# EAGLE schematic SP_proto (EAGLE 9.0.0)
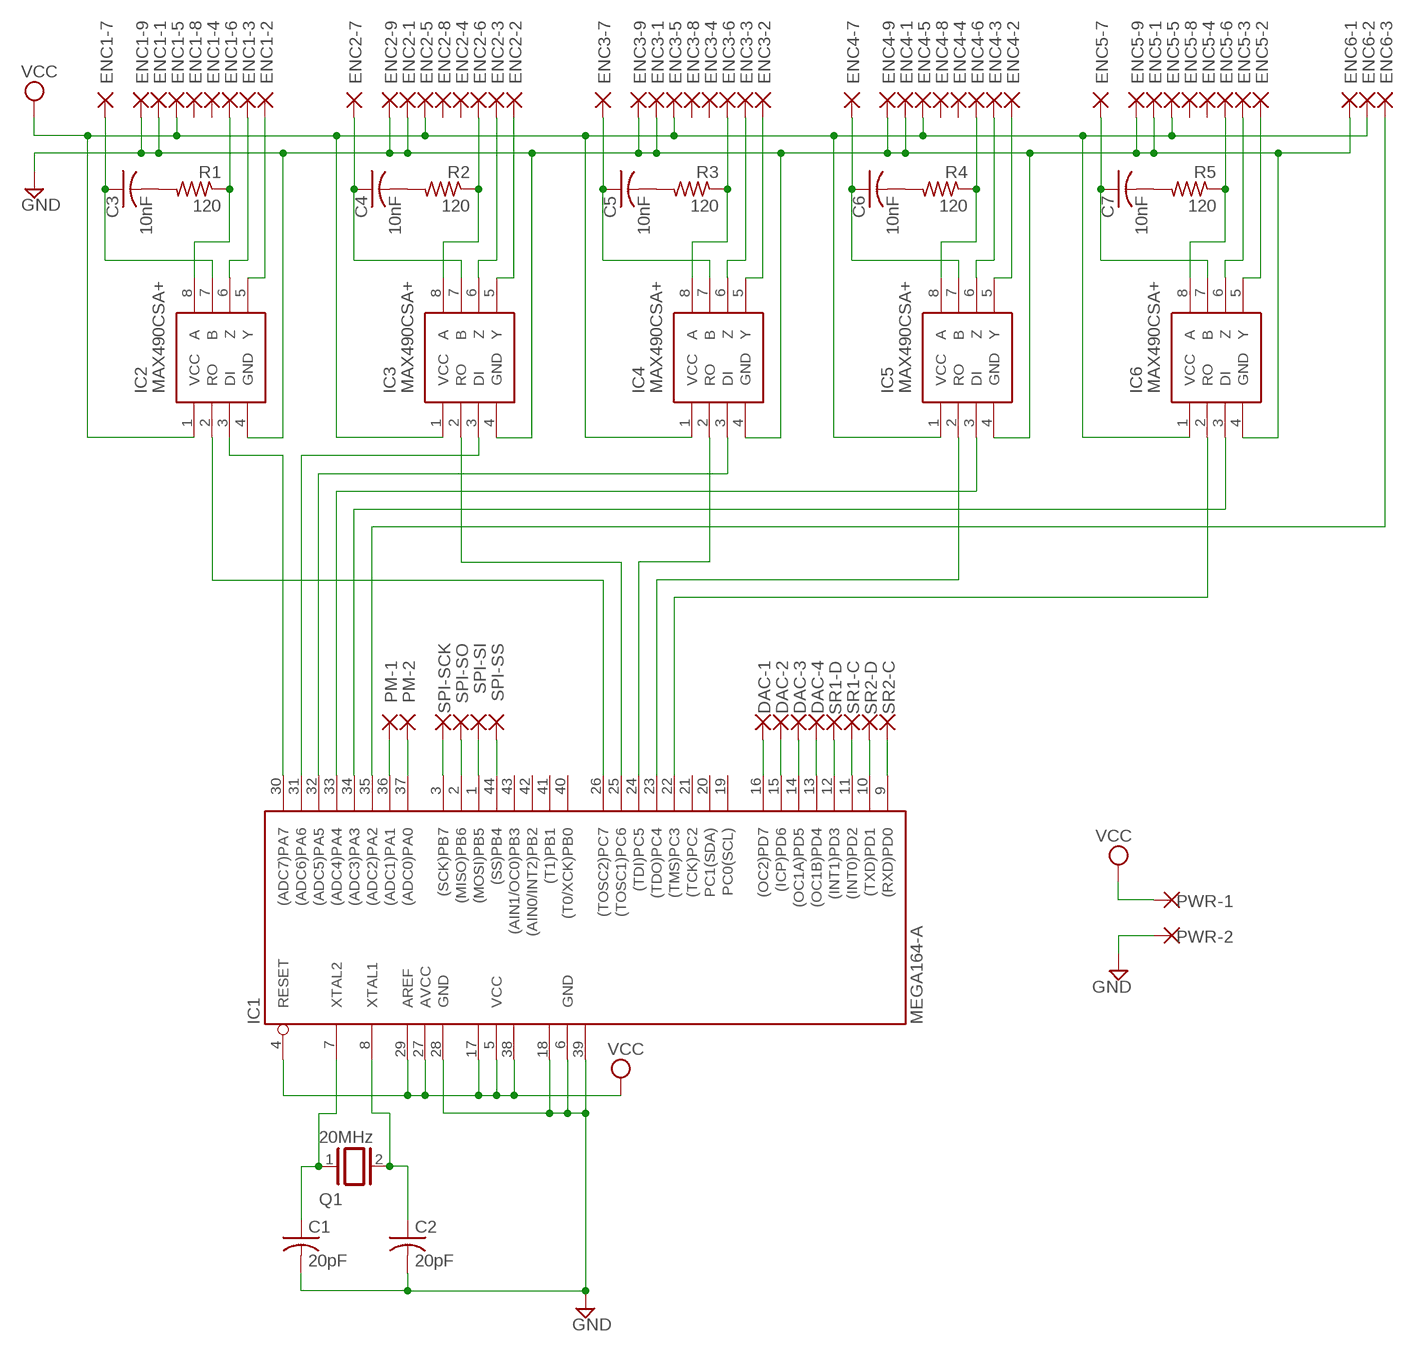
[diagram p0: schematic, sheet 1]

## Parts
C1  20pF  C-US050-024X044  [C050-024X044]
C2  20pF  C-US050-024X044  [C050-024X044]
C3  10nF  C-US050-024X044  [C050-024X044]
C4  10nF  C-US050-024X044  [C050-024X044]
C5  10nF  C-US050-024X044  [C050-024X044]
C6  10nF  C-US050-024X044  [C050-024X044]
C7  10nF  C-US050-024X044  [C050-024X044]
DAC-1  1,6/0,8  [1,6/0,8]
DAC-2  1,6/0,8  [1,6/0,8]
DAC-3  1,6/0,8  [1,6/0,8]
DAC-4  1,6/0,8  [1,6/0,8]
ENC1-1  1,6/0,8  [1,6/0,8]
ENC1-2  1,6/0,8  [1,6/0,8]
ENC1-3  1,6/0,8  [1,6/0,8]
ENC1-4  1,6/0,8  [1,6/0,8]
ENC1-5  1,6/0,8  [1,6/0,8]
ENC1-6  1,6/0,8  [1,6/0,8]
ENC1-7  1,6/0,8  [1,6/0,8]
ENC1-8  1,6/0,8  [1,6/0,8]
ENC1-9  1,6/0,8  [1,6/0,8]
ENC2-1  1,6/0,8  [1,6/0,8]
ENC2-2  1,6/0,8  [1,6/0,8]
ENC2-3  1,6/0,8  [1,6/0,8]
ENC2-4  1,6/0,8  [1,6/0,8]
ENC2-5  1,6/0,8  [1,6/0,8]
ENC2-6  1,6/0,8  [1,6/0,8]
ENC2-7  1,6/0,8  [1,6/0,8]
ENC2-8  1,6/0,8  [1,6/0,8]
ENC2-9  1,6/0,8  [1,6/0,8]
ENC3-1  1,6/0,8  [1,6/0,8]
ENC3-2  1,6/0,8  [1,6/0,8]
ENC3-3  1,6/0,8  [1,6/0,8]
ENC3-4  1,6/0,8  [1,6/0,8]
ENC3-5  1,6/0,8  [1,6/0,8]
ENC3-6  1,6/0,8  [1,6/0,8]
ENC3-7  1,6/0,8  [1,6/0,8]
ENC3-8  1,6/0,8  [1,6/0,8]
ENC3-9  1,6/0,8  [1,6/0,8]
ENC4-1  1,6/0,8  [1,6/0,8]
ENC4-2  1,6/0,8  [1,6/0,8]
ENC4-3  1,6/0,8  [1,6/0,8]
ENC4-4  1,6/0,8  [1,6/0,8]
ENC4-5  1,6/0,8  [1,6/0,8]
ENC4-6  1,6/0,8  [1,6/0,8]
ENC4-7  1,6/0,8  [1,6/0,8]
ENC4-8  1,6/0,8  [1,6/0,8]
ENC4-9  1,6/0,8  [1,6/0,8]
ENC5-1  1,6/0,8  [1,6/0,8]
ENC5-2  1,6/0,8  [1,6/0,8]
ENC5-3  1,6/0,8  [1,6/0,8]
ENC5-4  1,6/0,8  [1,6/0,8]
ENC5-5  1,6/0,8  [1,6/0,8]
ENC5-6  1,6/0,8  [1,6/0,8]
ENC5-7  1,6/0,8  [1,6/0,8]
ENC5-8  1,6/0,8  [1,6/0,8]
ENC5-9  1,6/0,8  [1,6/0,8]
ENC6-1  1,6/0,8  [1,6/0,8]
ENC6-2  1,6/0,8  [1,6/0,8]
ENC6-3  1,6/0,8  [1,6/0,8]
IC1  MEGA164-A  MEGA16-A  [TQFP44]
IC2  MAX490CSA+  [SOIC127P600X175-8N]
IC3  MAX490CSA+  [SOIC127P600X175-8N]
IC4  MAX490CSA+  [SOIC127P600X175-8N]
IC5  MAX490CSA+  [SOIC127P600X175-8N]
IC6  MAX490CSA+  [SOIC127P600X175-8N]
PM-1  1,6/0,8  [1,6/0,8]
PM-2  1,6/0,8  [1,6/0,8]
PWR-1  1,6/0,8  [1,6/0,8]
PWR-2  1,6/0,8  [1,6/0,8]
Q1  20MHz  XTAL/S  [QS]
R1  120  R-US_0204/7  [0204/7]
R2  120  R-US_0204/7  [0204/7]
R3  120  R-US_0204/7  [0204/7]
R4  120  R-US_0204/7  [0204/7]
R5  120  R-US_0204/7  [0204/7]
SPI-SCK  1,6/0,8  [1,6/0,8]
SPI-SI  1,6/0,8  [1,6/0,8]
SPI-SO  1,6/0,8  [1,6/0,8]
SPI-SS  1,6/0,8  [1,6/0,8]
SR1-C  1,6/0,8  [1,6/0,8]
SR1-D  1,6/0,8  [1,6/0,8]
SR2-C  1,6/0,8  [1,6/0,8]
SR2-D  1,6/0,8  [1,6/0,8]

## Nets
GND: C1.2 C2.2 ENC1-1.1(P) ENC1-9.1(P) ENC2-1.1(P) ENC2-9.1(P) ENC3-1.1(P) ENC3-9.1(P) ENC4-1.1(P) ENC4-9.1(P) ENC5-1.1(P) ENC5-9.1(P) ENC6-1.1(P) IC1.6(GND) IC1.18(GND1) IC1.28(GND) IC1.39(GND2) IC2.4(GND) IC3.4(GND) IC4.4(GND) IC5.4(GND) IC6.4(GND) PWR-2.1(P)
N$1: IC1.44((SS)PB4) SPI-SS.1(P)
N$2: IC1.1((MOSI)PB5) SPI-SI.1(P)
N$3: ENC2-2.1(P) IC3.5(Y)
N$4: ENC2-3.1(P) IC3.6(Z)
N$5: ENC2-6.1(P) IC3.8(A) R2.1
N$6: IC1.2((MISO)PB6) SPI-SO.1(P)
N$7: C4.2 R2.2
N$8: C4.1 ENC2-7.1(P) IC3.7(B)
N$9: ENC3-2.1(P) IC4.5(Y)
N$10: ENC3-3.1(P) IC4.6(Z)
N$11: ENC3-6.1(P) IC4.8(A) R3.1
N$12: C5.2 R3.2
N$13: C5.1 ENC3-7.1(P) IC4.7(B)
N$14: ENC4-2.1(P) IC5.5(Y)
N$15: ENC4-3.1(P) IC5.6(Z)
N$16: ENC4-6.1(P) IC5.8(A) R4.1
N$17: C6.2 R4.2
N$18: C6.1 ENC4-7.1(P) IC5.7(B)
N$19: ENC5-2.1(P) IC6.5(Y)
N$20: ENC5-3.1(P) IC6.6(Z)
N$21: ENC5-6.1(P) IC6.8(A) R5.1
N$22: C7.2 R5.2
N$23: C7.1 ENC5-7.1(P) IC6.7(B)
N$36: C1.1 IC1.7(XTAL2) Q1.1
N$39: C2.1 IC1.8(XTAL1) Q1.2
N$40: IC1.3((SCK)PB7) SPI-SCK.1(P)
N$51: ENC1-2.1(P) IC2.5(Y)
N$53: ENC1-3.1(P) IC2.6(Z)
N$54: ENC6-3.1(P) IC1.35((ADC2)PA2)
N$55: IC1.31((ADC6)PA6) IC3.3(DI)
N$56: IC1.32((ADC5)PA5) IC4.3(DI)
N$57: IC1.33((ADC4)PA4) IC5.3(DI)
N$58: IC1.34((ADC3)PA3) IC6.3(DI)
N$59: IC1.26((TOSC2)PC7) IC2.2(RO)
N$60: IC1.25((TOSC1)PC6) IC3.2(RO)
N$61: IC1.24((TDI)PC5) IC4.2(RO)
N$62: IC1.22((TMS)PC3) IC6.2(RO)
N$64: IC1.23((TDO)PC4) IC5.2(RO)
N$67: DAC-1.1(P) IC1.16((OC2)PD7)
N$68: DAC-2.1(P) IC1.15((ICP)PD6)
N$69: DAC-3.1(P) IC1.14((OC1A)PD5)
N$70: DAC-4.1(P) IC1.13((OC1B)PD4)
N$71: IC1.12((INT1)PD3) SR1-D.1(P)
N$72: IC1.11((INT0)PD2) SR1-C.1(P)
N$73: IC1.10((TXD)PD1) SR2-D.1(P)
N$74: IC1.9((RXD)PD0) SR2-C.1(P)
N$75: IC1.36((ADC1)PA1) PM-1.1(P)
N$76: IC1.37((ADC0)PA0) PM-2.1(P)
N$79: IC1.30((ADC7)PA7) IC2.3(DI)
N$80: ENC1-6.1(P) IC2.8(A) R1.1
N$81: C3.2 R1.2
N$104: C3.1 ENC1-7.1(P) IC2.7(B)
VCC: ENC1-5.1(P) ENC2-5.1(P) ENC3-5.1(P) ENC4-5.1(P) ENC5-5.1(P) ENC6-2.1(P) IC1.4(RESET) IC1.5(VCC) IC1.17(VCC1) IC1.27(AVCC) IC1.29(AREF) IC1.38(VCC2) IC2.1(VCC) IC3.1(VCC) IC4.1(VCC) IC5.1(VCC) IC6.1(VCC) PWR-1.1(P)
Unconnected: ENC1-4.1(P) ENC1-8.1(P) ENC2-4.1(P) ENC2-8.1(P) ENC3-4.1(P) ENC3-8.1(P) ENC4-4.1(P) ENC4-8.1(P) ENC5-4.1(P) ENC5-8.1(P) IC1.19(PC0(SCL)) IC1.20(PC1(SDA)) IC1.21((TCK)PC2) IC1.40((T0/XCK)PB0) IC1.41((T1)PB1) IC1.42((AIN0/INT2)PB2) IC1.43((AIN1/OC0)PB3)

## Library data of the parts
C1-C7 = rcl:C-US: CAPACITOR, American symbol; SPICEPREFIX: C
DAC-1-DAC-4 ENC1-1-ENC1-9 ENC2-1-ENC2-9 ENC3-1-ENC3-9 ENC4-1-ENC4-9 ENC5-1-ENC5-9 ENC6-1-ENC6-3 PM-1 PM-2 PWR-1 PWR-2 SPI-SCK SPI-SI SPI-SO SPI-SS SR1-C SR1-D SR2-C SR2-D = wirepad:1,6/0,8: THROUGH-HOLE PAD
IC1 = atmel:MEGA16: MICROCONTROLLER 16 Kbytes FLASH 1 kbytes SRAM 512 bytes EEPROM USART 8-channel 10 bit ADC Source: avr.lbr; MPN: ATMEGA16-16AU; OC_FARNELL: 9171134; OC_NEWARK: 96K6515
IC2-IC6 = rasm_parts:MAX490CSA+: MAX490CSA+, Line Transceiver, RS-485, RS-422 2.5Mbit/s Differential, 5V, 8-Pin SOIC Source: Datasheet <http://datasheets.maximintegrated.com/en/ds/MAX1487-MAX491.pdf>; ARROW_PART_NUMBER: MAX490CSA+; ARROW_PRICE/STOCK: http://uk.rs-online.com/web/p/products/6228181P; DESCRIPTION: MAX490CSA+, Line Transceiver, RS-485, RS-422 2.5Mbit/s Differential, 5V, 8-Pin SOIC; HEIGHT: 1.75mm; MANUFACTURER_NAME: Maxim Integrated; MANUFACTURER_PART_NUMBER: MAX490CSA+; RS_PART_NUMBER: 6228181P; RS_PRICE/STOCK: http://uk.rs-online.com/web/p/products/6228181P
Q1 = special:XTAL/S: CRYSTAL
R1-R5 = rcl:R-US_: RESISTOR, American symbol; SPICEPREFIX: R